# EAGLE design KGM 6DOF v1.0 (EAGLE 5.11)
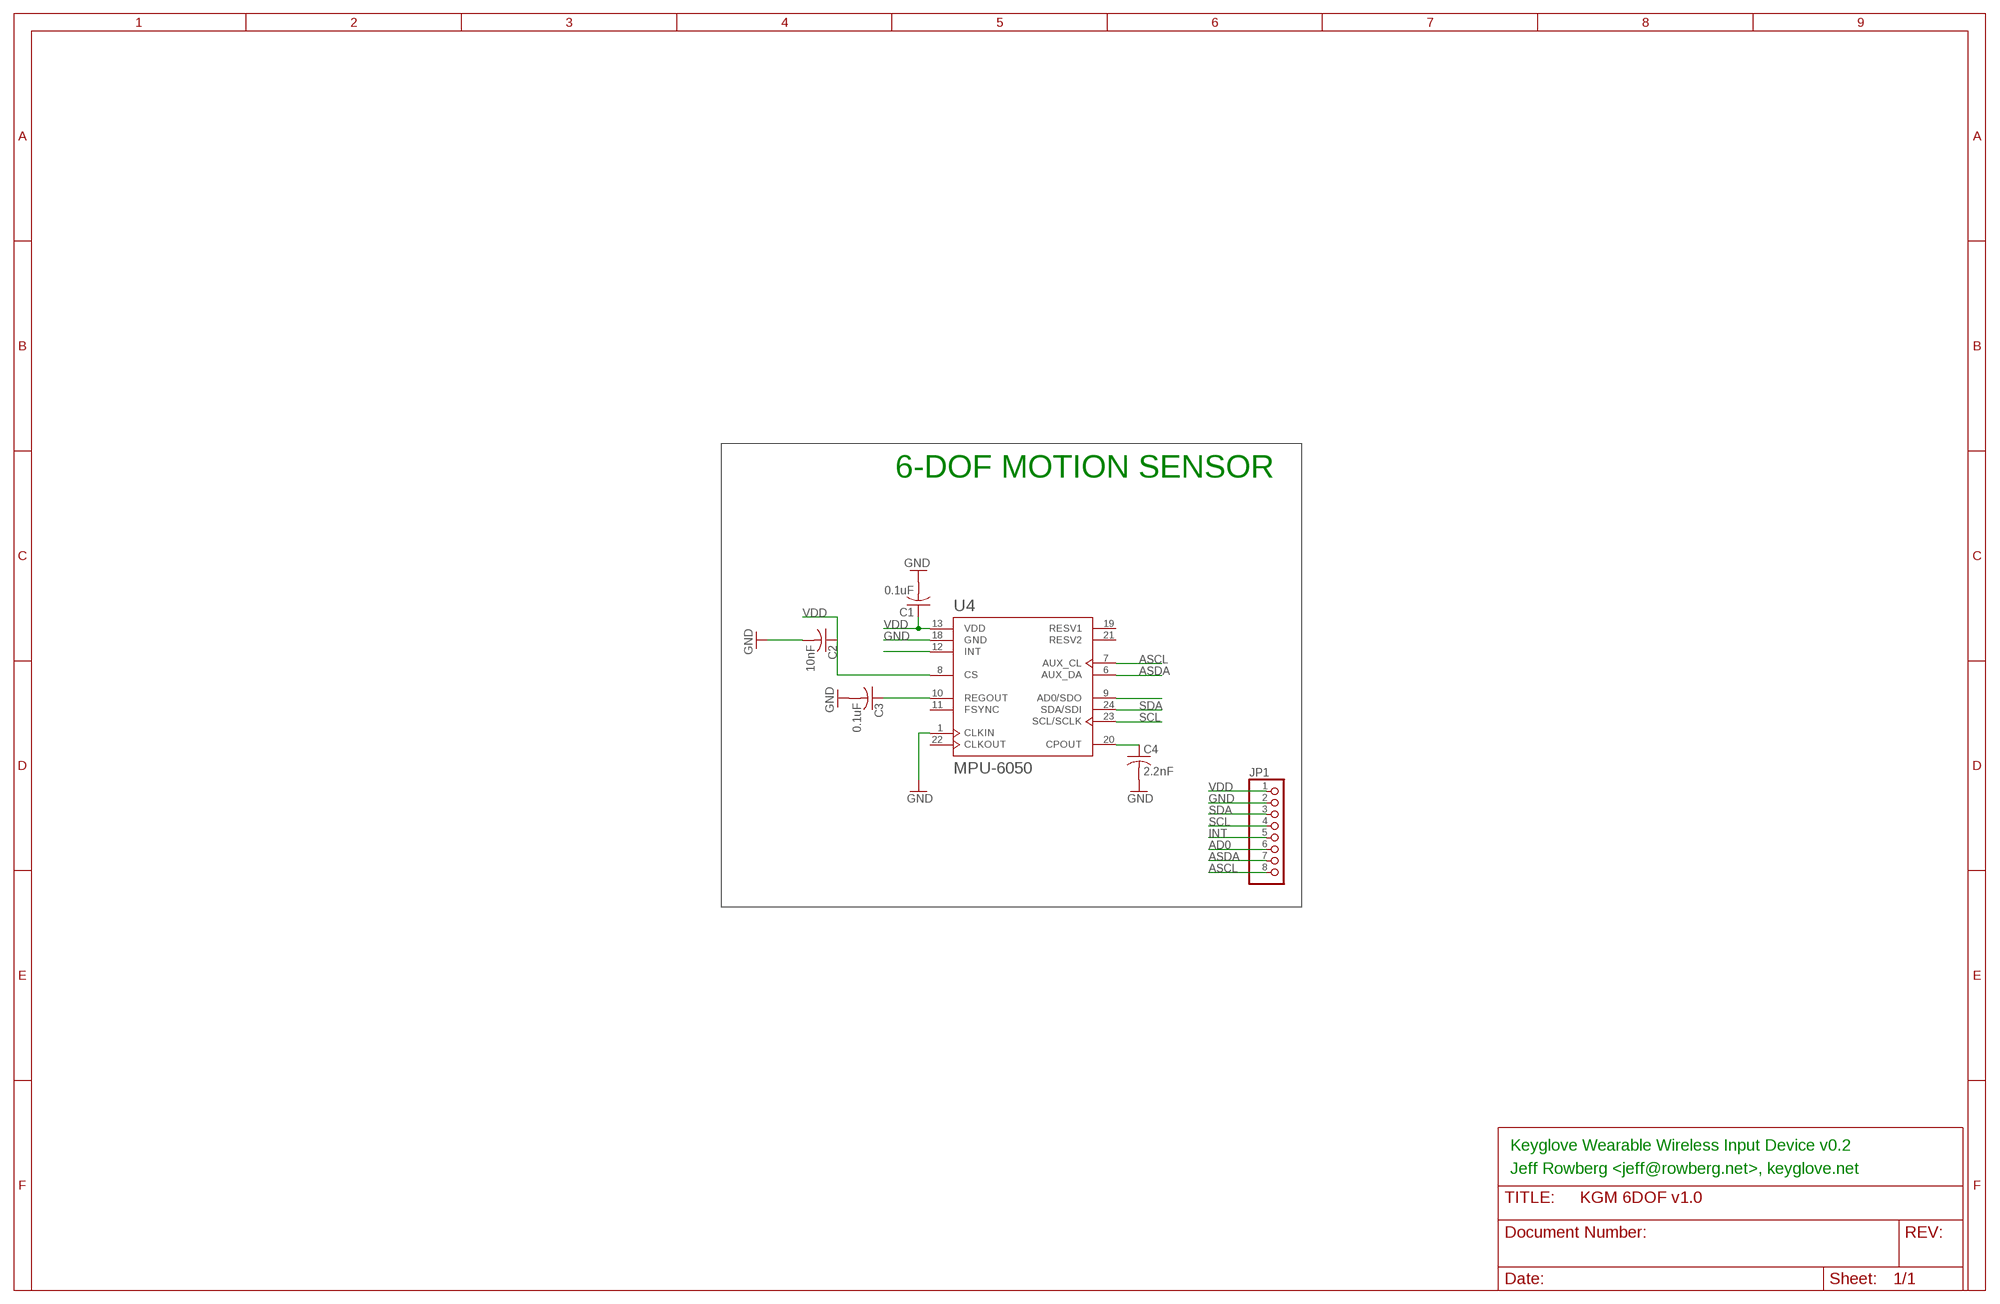
[diagram p0: schematic, sheet 1]

## Parts
C1  0.1uF  C-USC0603  [C0603]
C2  10nF  C-USC0603  [C0603]
C3  0.1uF  C-USC0603  [C0603]
C4  2.2nF  C-USC0603  [C0603]
JP1  PINHD-1X8  [1X08]
U4  MPU-6050  MPU-6000  [QFN24MPU]

## Nets
AD0: JP1.6 U4.9(AD0/SDO)
ASCL: JP1.8 U4.7(AUX_CL)
ASDA: JP1.7 U4.6(AUX_DA)
GND [power]: C1.2 C2.2 C3.2 C4.2 JP1.2 U4.1(CLKIN) U4.18(GND)
INT: JP1.5 U4.12(INT)
N$16: C4.1 U4.20(CPOUT)
N$17: C3.1 U4.10(REGOUT)
SCL: JP1.4 U4.23(SCL/SCLK)
SDA: JP1.3 U4.24(SDA/SDI)
VDD [power]: C1.1 C2.1 JP1.1 U4.8(CS) U4.13(VDD)
Unconnected: U4.11(FSYNC) U4.19(RESV1) U4.21(RESV2) U4.22(CLKOUT)

## Notes on the sheet
- 6-DOF MOTION SENSOR
- Keyglove Wearable Wireless Input Device v0.2
- Jeff Rowberg <jeff@rowberg.net>, keyglove.net

## Library data of the parts
C1-C4 = resistor:C-US: CAPACITOR, American symbol
JP1 = sf-pinhead:PINHD-1X8: PIN HEADER
U4 = sf-invensense:MPU-6000

## Net classes
0 default: width 0.254 mm, drill 0.305 mm, clearance 0.152 mm
1 power: width 0.254 mm, drill 0.305 mm, clearance 0.152 mm

## Board
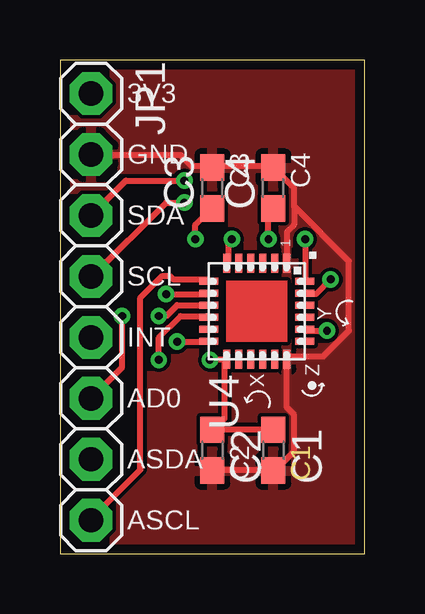
[diagram p1: board, top side]
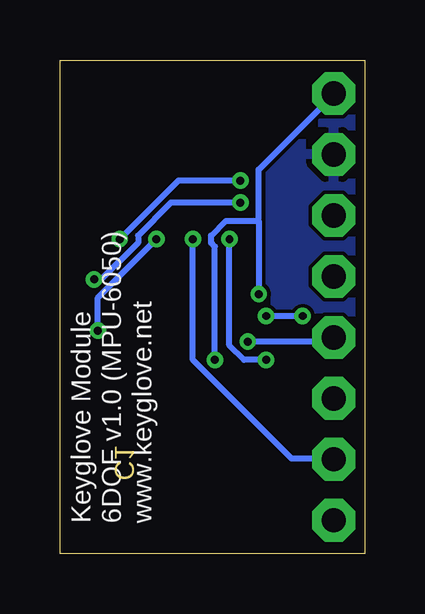
[diagram p2: board, bottom side, seen from below]

Size 12.7 x 20.57 mm. Coordinates in mm from the lower left corner, seen from the top.
Outline: 0,0 12.7,0 12.7,20.57 0,20.57 0,0
Copper layers (1*16): Top 0.0356mm / dielectric 1.5011mm / Bottom 0.0356mm
Design rules "LaenPCBOrder": minimum track width 6mil, minimum drill 13mil, track to track 6mil, track to pad 6mil, pad to pad 6mil, via to via 6mil, smd to smd 6mil, copper to edge 15mil, drill to drill 6mil, minimum pad ring 7mil, minimum via ring 7mil, stop-mask expansion 4mil, vias tented up to drill 20mil, thermal gap 10mil

### Footprints (pad centres in the part's own frame; a part is rotated, then mirrored left to right if it is on the bottom)
C0603 = smd 1.1 x 1: 1 -0.85,0; 2 0.85,0
1X08 = drill 1.016 pad 1.778 octagon: 1 -8.89,0; 2 -6.35,0; 3 -3.81,0; 4 -1.27,0; 5 1.27,0; 6 3.81,0; 7 6.35,0; 8 8.89,0
QFN24MPU = smd 0.8 x 0.3: 1 -2,1.25; 2 -2,0.75; 3 -2,0.25; 4 -2,-0.25; 5 -2,-0.75; 6 -2,-1.25; 13 2,-1.25; 14 2,-0.75; 15 2,-0.25; 16 2,0.25; 17 2,0.75; 18 2,1.25 | smd 0.3 x 0.8: 7 -1.25,-2; 8 -0.75,-2; 9 -0.25,-2; 10 0.25,-2; 11 0.75,-2; 12 1.25,-2; 19 1.25,2; 20 0.75,2; 21 0.25,2; 22 -0.25,2; 23 -0.75,2; 24 -1.25,2

### Placement (x,y rotation side)
C1  8.89,4.32 270 top
C2  6.35,4.32 270 top
C3  6.35,15.24 90 top
C4  8.89,15.24 90 top
JP1  1.3,10.29 270 top
U4  8.2,10.11 270 top

### Tracks (layer width: path | path; a pad name or v marks a point on that pad's centre or on a via)
AD0  (via drill 0.33)
  Top 0.254: v4.12,9.91 4.42,9.91 4.88,10.36 6.1,10.36 U4.9 | v2.59,9.91 2.59,7.77 JP1.6
  Bottom 0.254: v2.59,9.91 v4.12,9.91
ASCL
  Top 0.254: U4.7 6.1,11.43 4.72,11.43 4.57,11.58 4.27,11.58 3.35,10.67 3.35,3.5 1.37,1.52 JP1.8
ASDA  (via drill 0.33)
  Top 0.254: v7.16,13.11 7.01,12.95 7.01,12.19 U4.6
  Bottom 0.254: v7.16,13.11 7.16,8.08 3.05,3.96 1.37,3.96 JP1.7
GND
  Top 0.254: C2.2 6.4,3.5 8.84,3.5 C1.2 8.99,3.5 9.75,4.27 9.75,5.79 9.45,6.1 9.45,8.08 U4.18 9.45,8.23 10.97,8.23 12.04,9.3 12.04,12.19 9.75,14.48 | 9.75,14.48 9.75,15.24 8.99,16 C4.2 8.84,16.15 6.4,16.15 C3.2 6.25,16.15 5.49,16.15 5.03,16.61 1.37,16.61 JP1.2 | 9.75,14.48 9.75,13.72 9.45,13.41 9.45,12.19 U4.1
  pour Bottom: 0.25,20.32 12.45,20.32 12.45,0.25 0.25,0.25
  pour Top: 0.25,20.32 12.45,20.32 12.45,0.25 0.25,0.25
INT  (via drill 0.33)
  Top 0.254: v4.88,8.84 6.1,8.84 U4.12
  Bottom 0.254: v4.88,8.84 1.52,8.84 1.37,8.99 JP1.5
N$16  (via drill 0.33)
  Top 0.254: v11.12,9.3 10.21,9.3 U4.20 | v8.69,13.11 8.69,14.17 8.84,14.33 C4.1
  Bottom 0.254: v11.12,9.3 11.12,10.67 v8.69,13.11
N$17  (via drill 0.33)
  Top 0.254: v4.12,8.08 4.12,8.99 5.03,9.91 6.1,9.91 U4.10 | v5.64,13.11 5.64,13.72 6.25,14.33 C3.1
  Bottom 0.254: v4.12,8.08 5.03,8.08 5.64,8.69 v5.64,13.11
SCL  (via drill 0.33)
  Top 0.254: v11.28,11.43 10.67,10.82 10.21,10.82 U4.23 | v5.18,14.63 4.42,14.63 1.37,11.58 JP1.4
  Bottom 0.254: v11.28,11.43 10.97,11.43 9.45,12.95 9.45,13.26 8.08,14.63 v5.18,14.63
SDA  (via drill 0.33)
  Top 0.254: v10.21,13.11 10.21,11.43 U4.24 | v5.18,15.54 2.74,15.54 JP1.3
  Bottom 0.254: v10.21,13.11 7.77,15.54 v5.18,15.54
VDD  (via drill 0.33)
  Top 0.254: 6.86,8.08 6.86,5.64 6.4,5.18 C2.1 6.55,5.18 8.84,5.18 C1.1 | v4.42,10.82 6.1,10.82 U4.8 | 6.86,8.08 v6.25,8.08 | 6.86,8.08 U4.13
  Bottom 0.254: 4.42,13.87 4.42,16 1.37,19.05 JP1.1 | 4.42,13.87 v4.42,10.82 | v6.25,8.08 6.25,12.8 6.4,12.95 6.4,13.26 5.79,13.87 4.42,13.87

### Text on the board
Dimension: C1
tPlace: 3V3 | GND | C3 | C4 | SDA | SCL | INT | AD0 | ASDA | C2 | ASCL
bPlace: www.keyglove.net | 6DOF v1.0 (MPU-6050) | Keyglove Module